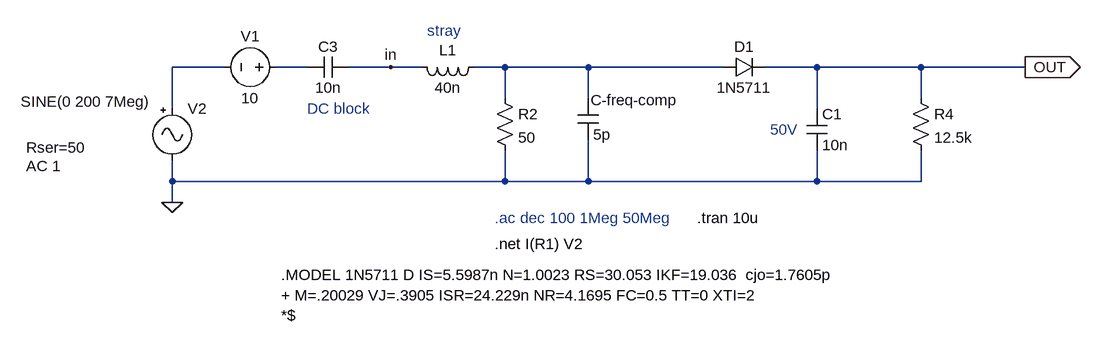
[diagram p0: schematic qrt-rf-power-meter-shunt-cap-compensation.asc]
qrt-rf-power-meter-shunt-cap-compensation.asc, the LTspice schematic file:
Version 4
SHEET 1 1720 680
WIRE -416 32 -496 32
WIRE -288 32 -336 32
WIRE -160 32 -224 32
WIRE -112 32 -160 32
WIRE 16 32 -32 32
WIRE 144 32 16 32
WIRE 352 32 144 32
WIRE 496 32 416 32
WIRE 656 32 496 32
WIRE 816 32 656 32
WIRE 16 80 16 32
WIRE 144 80 144 32
WIRE 656 80 656 32
WIRE -496 96 -496 32
WIRE 496 96 496 32
WIRE -496 208 -496 176
WIRE 16 208 16 160
WIRE 16 208 -496 208
WIRE 144 208 144 144
WIRE 144 208 16 208
WIRE 496 208 496 160
WIRE 496 208 144 208
WIRE 656 208 656 160
WIRE 656 208 496 208
WIRE -496 240 -496 208
FLAG -496 240 0
FLAG 816 32 OUT
IOPIN 816 32 Out
FLAG -160 32 in
SYMBOL diode 352 48 R270
WINDOW 0 32 32 VTop 2
WINDOW 3 0 32 VBottom 2
SYMATTR InstName D1
SYMATTR Value 1N5711
SYMBOL cap 480 96 R0
SYMATTR InstName C1
SYMATTR Value 10n
SYMBOL Misc\\signal -496 80 R0
WINDOW 3 -233 5 Left 2
WINDOW 123 -225 104 Left 2
WINDOW 39 -225 76 Left 2
SYMATTR Value SINE(0 200 7Meg)
SYMATTR Value2 AC 1
SYMATTR SpiceLine Rser=50
SYMATTR InstName V2
SYMBOL cap 128 80 R0
WINDOW 0 20 3 Left 2
SYMATTR InstName C-freq-comp
SYMATTR Value 5p
SYMBOL ind -16 16 R90
WINDOW 0 5 56 VBottom 2
WINDOW 3 32 56 VTop 2
SYMATTR InstName L1
SYMATTR Value 40n
SYMBOL voltage -320 32 R90
WINDOW 0 -32 56 VBottom 2
WINDOW 3 32 56 VTop 2
WINDOW 123 0 0 Left 0
WINDOW 39 0 0 Left 0
SYMATTR InstName V1
SYMATTR Value 10
SYMBOL cap -224 16 R90
WINDOW 0 0 32 VBottom 2
WINDOW 3 32 32 VTop 2
SYMATTR InstName C3
SYMATTR Value 10n
SYMBOL res 0 64 R0
SYMATTR InstName R2
SYMATTR Value 50
SYMBOL res 640 64 R0
SYMATTR InstName R4
SYMATTR Value 12.5k
TEXT 0 264 Left 2 ;.ac dec 100 1Meg 50Meg
TEXT 0 304 Left 2 !.net I(R1) V2
TEXT -328 352 Left 2 !.MODEL 1N5711 D IS=5.5987n N=1.0023 RS=30.053 IKF=19.036  cjo=1.7605p\n+ M=.20029 VJ=.3905 ISR=24.229n NR=4.1695 FC=0.5 TT=0 XTI=2\n*$
TEXT 312 264 Left 2 !.tran 10u
TEXT 424 128 Left 2 ;50V
TEXT -288 96 Left 2 ;DC block
TEXT -104 -24 Left 2 ;stray

The netlist it stands for:
* qrt-rf-power-meter-shunt-cap-compensation.asc
D1 N003 OUT 1N5711
C1 OUT 0 10n
V2 N001 0 SINE(0 200 7Meg) AC 1 Rser=50
C-freq-comp N003 0 5p
L1 N003 in 40n
V1 N002 N001 10
C3 in N002 10n
R2 N003 0 50
R4 OUT 0 12.5k
.model D D
.lib standard.dio
* .ac dec 100 1Meg 50Meg
.net I(R1) V2
.MODEL 1N5711 D IS=5.5987n N=1.0023 RS=30.053 IKF=19.036  cjo=1.7605p
+ M=.20029 VJ=.3905 ISR=24.229n NR=4.1695 FC=0.5 TT=0 XTI=2
*$
.tran 10u
* 50V
* DC block
* stray
.backanno
.end